# Vivado block design One_Digit, xc7a35tcpg236-1, Vivado 2018.3
create_bd_design One_Digit

create_bd_port -dir I clkin
create_bd_port -dir O A
create_bd_port -dir O B
create_bd_port -dir O C
create_bd_port -dir O D
create_bd_port -dir O E
create_bd_port -dir O F
create_bd_port -dir O G

create_bd_cell -type hier clk_divide_1Hz
create_bd_cell -type ip -vlnv xilinx.com:ip:c_counter_binary:12.0 c_counter_binary_0
set_property -dict {CONFIG.Final_Count_Value 9 CONFIG.Output_Width 4 CONFIG.Restrict_Count true} [get_bd_cells c_counter_binary_0]
create_bd_cell -type hier Seg_Decoder
create_bd_cell -type ip -vlnv xilinx.com:ip:xlslice:1.0 xlslice_0
set_property -dict {CONFIG.DIN_FROM 0 CONFIG.DIN_TO 0 CONFIG.DIN_WIDTH 4} [get_bd_cells xlslice_0]
create_bd_cell -type ip -vlnv xilinx.com:ip:xlslice:1.0 xlslice_1
set_property -dict {CONFIG.DIN_FROM 1 CONFIG.DIN_TO 1 CONFIG.DIN_WIDTH 4 CONFIG.DOUT_WIDTH 1} [get_bd_cells xlslice_1]
create_bd_cell -type ip -vlnv xilinx.com:ip:xlslice:1.0 xlslice_2
set_property -dict {CONFIG.DIN_FROM 2 CONFIG.DIN_TO 2 CONFIG.DIN_WIDTH 4 CONFIG.DOUT_WIDTH 1} [get_bd_cells xlslice_2]
create_bd_cell -type ip -vlnv xilinx.com:ip:xlslice:1.0 xlslice_3
set_property -dict {CONFIG.DIN_FROM 3 CONFIG.DIN_TO 3 CONFIG.DIN_WIDTH 4 CONFIG.DOUT_WIDTH 1} [get_bd_cells xlslice_3]

# ---- hierarchy /clk_divide_1Hz ----
current_bd_instance /clk_divide_1Hz
create_bd_pin -dir I clkin_0
create_bd_pin -dir O clkout_0

create_bd_cell -type ip -vlnv xilinx.com:xup:xup_clk_divider:1.0 xup_clk_divider_15
create_bd_cell -type ip -vlnv xilinx.com:xup:xup_clk_divider:1.0 xup_clk_divider_2
create_bd_cell -type ip -vlnv xilinx.com:xup:xup_clk_divider:1.0 xup_clk_divider_16
create_bd_cell -type ip -vlnv xilinx.com:xup:xup_clk_divider:1.0 xup_clk_divider_3
create_bd_cell -type ip -vlnv xilinx.com:xup:xup_clk_divider:1.0 xup_clk_divider_17
create_bd_cell -type ip -vlnv xilinx.com:xup:xup_clk_divider:1.0 xup_clk_divider_4
create_bd_cell -type ip -vlnv xilinx.com:xup:xup_clk_divider:1.0 xup_clk_divider_18
create_bd_cell -type ip -vlnv xilinx.com:xup:xup_clk_divider:1.0 xup_clk_divider_5
create_bd_cell -type ip -vlnv xilinx.com:xup:xup_clk_divider:1.0 xup_clk_divider_19
create_bd_cell -type ip -vlnv xilinx.com:xup:xup_clk_divider:1.0 xup_clk_divider_6
create_bd_cell -type ip -vlnv xilinx.com:xup:xup_clk_divider:1.0 xup_clk_divider_7
create_bd_cell -type ip -vlnv xilinx.com:xup:xup_clk_divider:1.0 xup_clk_divider_20
create_bd_cell -type ip -vlnv xilinx.com:xup:xup_clk_divider:1.0 xup_clk_divider_8
create_bd_cell -type ip -vlnv xilinx.com:xup:xup_clk_divider:1.0 xup_clk_divider_21
create_bd_cell -type ip -vlnv xilinx.com:xup:xup_clk_divider:1.0 xup_clk_divider_9
create_bd_cell -type ip -vlnv xilinx.com:xup:xup_clk_divider:1.0 xup_clk_divider_22
create_bd_cell -type ip -vlnv xilinx.com:xup:xup_clk_divider:1.0 xup_clk_divider_10
create_bd_cell -type ip -vlnv xilinx.com:xup:xup_clk_divider:1.0 xup_clk_divider_23
create_bd_cell -type ip -vlnv xilinx.com:xup:xup_clk_divider:1.0 xup_clk_divider_11
create_bd_cell -type ip -vlnv xilinx.com:xup:xup_clk_divider:1.0 xup_clk_divider_24
create_bd_cell -type ip -vlnv xilinx.com:xup:xup_clk_divider:1.0 xup_clk_divider_12
create_bd_cell -type ip -vlnv xilinx.com:xup:xup_clk_divider:1.0 xup_clk_divider_25
create_bd_cell -type ip -vlnv xilinx.com:xup:xup_clk_divider:1.0 xup_clk_divider_13
create_bd_cell -type ip -vlnv xilinx.com:xup:xup_clk_divider:1.0 xup_clk_divider_0
create_bd_cell -type ip -vlnv xilinx.com:xup:xup_clk_divider:1.0 xup_clk_divider_26
create_bd_cell -type ip -vlnv xilinx.com:xup:xup_clk_divider:1.0 xup_clk_divider_14
create_bd_cell -type ip -vlnv xilinx.com:xup:xup_clk_divider:1.0 xup_clk_divider_1

# ---- hierarchy /Seg_Decoder ----
current_bd_instance /Seg_Decoder
create_bd_pin -dir O A
create_bd_pin -dir O B
create_bd_pin -dir O C
create_bd_pin -dir O D
create_bd_pin -dir O E
create_bd_pin -dir O F
create_bd_pin -dir O G
create_bd_pin -dir I X0
create_bd_pin -dir I X1
create_bd_pin -dir I X2
create_bd_pin -dir I X3

create_bd_cell -type hier segment_A
create_bd_cell -type hier segment_B
create_bd_cell -type hier segment_C
create_bd_cell -type hier segment_D
create_bd_cell -type hier segment_E
create_bd_cell -type hier segment_F
create_bd_cell -type hier segment_G

# ---- hierarchy /Seg_Decoder/segment_A ----
current_bd_instance /Seg_Decoder/segment_A
create_bd_pin -dir O A
create_bd_pin -dir I X0
create_bd_pin -dir I X1
create_bd_pin -dir I X2
create_bd_pin -dir I X3

create_bd_cell -type ip -vlnv xilinx.com:xup:xup_and3:1.0 xup_and3_0
set_property -dict {CONFIG.DELAY 0} [get_bd_cells xup_and3_0]
create_bd_cell -type ip -vlnv xilinx.com:xup:xup_and4:1.0 xup_and4_0
set_property -dict {CONFIG.DELAY 0} [get_bd_cells xup_and4_0]
create_bd_cell -type ip -vlnv xilinx.com:xup:xup_inv:1.0 xup_inv_0
set_property -dict {CONFIG.DELAY 0} [get_bd_cells xup_inv_0]
create_bd_cell -type ip -vlnv xilinx.com:xup:xup_inv:1.0 xup_inv_1
set_property -dict {CONFIG.DELAY 0} [get_bd_cells xup_inv_1]
create_bd_cell -type ip -vlnv xilinx.com:xup:xup_inv:1.0 xup_inv_2
set_property -dict {CONFIG.DELAY 0} [get_bd_cells xup_inv_2]
create_bd_cell -type ip -vlnv xilinx.com:xup:xup_inv:1.0 xup_inv_3
set_property -dict {CONFIG.DELAY 0} [get_bd_cells xup_inv_3]
create_bd_cell -type ip -vlnv xilinx.com:xup:xup_inv:1.0 xup_inv_4
set_property -dict {CONFIG.DELAY 0} [get_bd_cells xup_inv_4]
create_bd_cell -type ip -vlnv xilinx.com:xup:xup_or2:1.0 xup_or2_0
set_property -dict {CONFIG.DELAY 0} [get_bd_cells xup_or2_0]

# ---- hierarchy /Seg_Decoder/segment_B ----
current_bd_instance /Seg_Decoder/segment_B
create_bd_pin -dir O B
create_bd_pin -dir I X0
create_bd_pin -dir I X1
create_bd_pin -dir I X2

create_bd_cell -type ip -vlnv xilinx.com:xup:xup_and2:1.0 xup_and2_0
set_property -dict {CONFIG.DELAY 0} [get_bd_cells xup_and2_0]
create_bd_cell -type ip -vlnv xilinx.com:xup:xup_xor2:1.0 xup_xor2_0
set_property -dict {CONFIG.DELAY 0} [get_bd_cells xup_xor2_0]

# ---- hierarchy /Seg_Decoder/segment_C ----
current_bd_instance /Seg_Decoder/segment_C
create_bd_pin -dir O C
create_bd_pin -dir I X0
create_bd_pin -dir I X1
create_bd_pin -dir I X2

create_bd_cell -type ip -vlnv xilinx.com:xup:xup_and3:1.0 xup_and3_0
set_property -dict {CONFIG.DELAY 0} [get_bd_cells xup_and3_0]
create_bd_cell -type ip -vlnv xilinx.com:xup:xup_inv:1.0 xup_inv_0
set_property -dict {CONFIG.DELAY 0} [get_bd_cells xup_inv_0]
create_bd_cell -type ip -vlnv xilinx.com:xup:xup_inv:1.0 xup_inv_1
set_property -dict {CONFIG.DELAY 0} [get_bd_cells xup_inv_1]

# ---- hierarchy /Seg_Decoder/segment_D ----
current_bd_instance /Seg_Decoder/segment_D
create_bd_pin -dir O D
create_bd_pin -dir I X0
create_bd_pin -dir I X1
create_bd_pin -dir I X2
create_bd_pin -dir I X3

create_bd_cell -type ip -vlnv xilinx.com:xup:xup_and2:1.0 xup_and2_0
set_property -dict {CONFIG.DELAY 0} [get_bd_cells xup_and2_0]
create_bd_cell -type ip -vlnv xilinx.com:xup:xup_and4:1.0 xup_and4_0
set_property -dict {CONFIG.DELAY 0} [get_bd_cells xup_and4_0]
create_bd_cell -type ip -vlnv xilinx.com:xup:xup_inv:1.0 xup_inv_0
set_property -dict {CONFIG.DELAY 0} [get_bd_cells xup_inv_0]
create_bd_cell -type ip -vlnv xilinx.com:xup:xup_inv:1.0 xup_inv_1
set_property -dict {CONFIG.DELAY 0} [get_bd_cells xup_inv_1]
create_bd_cell -type ip -vlnv xilinx.com:xup:xup_inv:1.0 xup_inv_2
set_property -dict {CONFIG.DELAY 0} [get_bd_cells xup_inv_2]
create_bd_cell -type ip -vlnv xilinx.com:xup:xup_inv:1.0 xup_inv_3
set_property -dict {CONFIG.DELAY 0} [get_bd_cells xup_inv_3]
create_bd_cell -type ip -vlnv xilinx.com:xup:xup_or2:1.0 xup_or2_0
set_property -dict {CONFIG.DELAY 0} [get_bd_cells xup_or2_0]
create_bd_cell -type ip -vlnv xilinx.com:xup:xup_xor2:1.0 xup_xor2_0
set_property -dict {CONFIG.DELAY 0} [get_bd_cells xup_xor2_0]

# ---- hierarchy /Seg_Decoder/segment_E ----
current_bd_instance /Seg_Decoder/segment_E
create_bd_pin -dir O E
create_bd_pin -dir I X0
create_bd_pin -dir I X1
create_bd_pin -dir I X2

create_bd_cell -type ip -vlnv xilinx.com:xup:xup_and2:1.0 xup_and2_0
set_property -dict {CONFIG.DELAY 0} [get_bd_cells xup_and2_0]
create_bd_cell -type ip -vlnv xilinx.com:xup:xup_inv:1.0 xup_inv_0
set_property -dict {CONFIG.DELAY 0} [get_bd_cells xup_inv_0]
create_bd_cell -type ip -vlnv xilinx.com:xup:xup_or2:1.0 xup_or2_0
set_property -dict {CONFIG.DELAY 0} [get_bd_cells xup_or2_0]

# ---- hierarchy /Seg_Decoder/segment_F ----
current_bd_instance /Seg_Decoder/segment_F
create_bd_pin -dir O F
create_bd_pin -dir I X0
create_bd_pin -dir I X1
create_bd_pin -dir I X2
create_bd_pin -dir I X3

create_bd_cell -type ip -vlnv xilinx.com:xup:xup_and2:1.0 xup_and2_0
set_property -dict {CONFIG.DELAY 0} [get_bd_cells xup_and2_0]
create_bd_cell -type ip -vlnv xilinx.com:xup:xup_and2:1.0 xup_and2_1
set_property -dict {CONFIG.DELAY 0} [get_bd_cells xup_and2_1]
create_bd_cell -type ip -vlnv xilinx.com:xup:xup_and2:1.0 xup_and2_2
set_property -dict {CONFIG.DELAY 0} [get_bd_cells xup_and2_2]
create_bd_cell -type ip -vlnv xilinx.com:xup:xup_inv:1.0 xup_inv_0
set_property -dict {CONFIG.DELAY 0} [get_bd_cells xup_inv_0]
create_bd_cell -type ip -vlnv xilinx.com:xup:xup_inv:1.0 xup_inv_2
set_property -dict {CONFIG.DELAY 0} [get_bd_cells xup_inv_2]
create_bd_cell -type ip -vlnv xilinx.com:xup:xup_or2:1.0 xup_or2_0
set_property -dict {CONFIG.DELAY 0} [get_bd_cells xup_or2_0]
create_bd_cell -type ip -vlnv xilinx.com:xup:xup_or2:1.0 xup_or2_1
set_property -dict {CONFIG.DELAY 0} [get_bd_cells xup_or2_1]

# ---- hierarchy /Seg_Decoder/segment_G ----
current_bd_instance /Seg_Decoder/segment_G
create_bd_pin -dir O G
create_bd_pin -dir I X0
create_bd_pin -dir I X1
create_bd_pin -dir I X2
create_bd_pin -dir I X3

create_bd_cell -type ip -vlnv xilinx.com:xup:xup_and3:1.0 xup_and3_0
set_property -dict {CONFIG.DELAY 0} [get_bd_cells xup_and3_0]
create_bd_cell -type ip -vlnv xilinx.com:xup:xup_and3:1.0 xup_and3_1
set_property -dict {CONFIG.DELAY 0} [get_bd_cells xup_and3_1]
create_bd_cell -type ip -vlnv xilinx.com:xup:xup_inv:1.0 xup_inv_0
set_property -dict {CONFIG.DELAY 0} [get_bd_cells xup_inv_0]
create_bd_cell -type ip -vlnv xilinx.com:xup:xup_inv:1.0 xup_inv_1
set_property -dict {CONFIG.DELAY 0} [get_bd_cells xup_inv_1]
create_bd_cell -type ip -vlnv xilinx.com:xup:xup_inv:1.0 xup_inv_2
set_property -dict {CONFIG.DELAY 0} [get_bd_cells xup_inv_2]
create_bd_cell -type ip -vlnv xilinx.com:xup:xup_or2:1.0 xup_or2_0
set_property -dict {CONFIG.DELAY 0} [get_bd_cells xup_or2_0]

# ---- connections ----

current_bd_instance /clk_divide_1Hz
connect_bd_net [get_bd_pins xup_clk_divider_14/clkout] [get_bd_pins xup_clk_divider_15/clkin]
connect_bd_net [get_bd_pins xup_clk_divider_15/clkout] [get_bd_pins xup_clk_divider_16/clkin]
connect_bd_net [get_bd_pins xup_clk_divider_1/clkout] [get_bd_pins xup_clk_divider_2/clkin]
connect_bd_net [get_bd_pins xup_clk_divider_2/clkout] [get_bd_pins xup_clk_divider_3/clkin]
connect_bd_net [get_bd_pins xup_clk_divider_16/clkout] [get_bd_pins xup_clk_divider_17/clkin]
connect_bd_net [get_bd_pins xup_clk_divider_3/clkout] [get_bd_pins xup_clk_divider_4/clkin]
connect_bd_net [get_bd_pins xup_clk_divider_17/clkout] [get_bd_pins xup_clk_divider_18/clkin]
connect_bd_net [get_bd_pins xup_clk_divider_4/clkout] [get_bd_pins xup_clk_divider_5/clkin]
connect_bd_net [get_bd_pins xup_clk_divider_18/clkout] [get_bd_pins xup_clk_divider_19/clkin]
connect_bd_net [get_bd_pins xup_clk_divider_5/clkout] [get_bd_pins xup_clk_divider_6/clkin]
connect_bd_net [get_bd_pins xup_clk_divider_19/clkout] [get_bd_pins xup_clk_divider_20/clkin]
connect_bd_net [get_bd_pins xup_clk_divider_6/clkout] [get_bd_pins xup_clk_divider_7/clkin]
connect_bd_net [get_bd_pins xup_clk_divider_7/clkout] [get_bd_pins xup_clk_divider_8/clkin]
connect_bd_net [get_bd_pins xup_clk_divider_20/clkout] [get_bd_pins xup_clk_divider_21/clkin]
connect_bd_net [get_bd_pins xup_clk_divider_8/clkout] [get_bd_pins xup_clk_divider_9/clkin]
connect_bd_net [get_bd_pins xup_clk_divider_21/clkout] [get_bd_pins xup_clk_divider_22/clkin]
connect_bd_net [get_bd_pins xup_clk_divider_9/clkout] [get_bd_pins xup_clk_divider_10/clkin]
connect_bd_net [get_bd_pins xup_clk_divider_22/clkout] [get_bd_pins xup_clk_divider_23/clkin]
connect_bd_net [get_bd_pins xup_clk_divider_10/clkout] [get_bd_pins xup_clk_divider_11/clkin]
connect_bd_net [get_bd_pins xup_clk_divider_23/clkout] [get_bd_pins xup_clk_divider_24/clkin]
connect_bd_net [get_bd_pins xup_clk_divider_11/clkout] [get_bd_pins xup_clk_divider_12/clkin]
connect_bd_net [get_bd_pins xup_clk_divider_24/clkout] [get_bd_pins xup_clk_divider_25/clkin]
connect_bd_net [get_bd_pins xup_clk_divider_12/clkout] [get_bd_pins xup_clk_divider_13/clkin]
connect_bd_net [get_bd_pins xup_clk_divider_25/clkout] [get_bd_pins xup_clk_divider_26/clkin]
connect_bd_net [get_bd_pins xup_clk_divider_13/clkout] [get_bd_pins xup_clk_divider_14/clkin]
connect_bd_net [get_bd_pins xup_clk_divider_0/clkout] [get_bd_pins xup_clk_divider_1/clkin]
connect_bd_net -net clkin_0_1 [get_bd_pins clkin_0] [get_bd_pins xup_clk_divider_0/clkin]
connect_bd_net [get_bd_pins xup_clk_divider_26/clkout] [get_bd_pins clkout_0]

current_bd_instance /Seg_Decoder
connect_bd_net -net a_0_1 [get_bd_pins X2] \
  [get_bd_pins segment_A/X2] [get_bd_pins segment_B/X2] [get_bd_pins segment_C/X2] [get_bd_pins segment_D/X2] \
  [get_bd_pins segment_E/X2] [get_bd_pins segment_F/X2] [get_bd_pins segment_G/X2]
connect_bd_net -net a_0_2 [get_bd_pins X3] [get_bd_pins segment_A/X3] [get_bd_pins segment_D/X3] [get_bd_pins segment_F/X3] [get_bd_pins segment_G/X3]
connect_bd_net -net a_1_1 [get_bd_pins X1] \
  [get_bd_pins segment_A/X1] [get_bd_pins segment_B/X1] [get_bd_pins segment_C/X1] [get_bd_pins segment_D/X1] \
  [get_bd_pins segment_E/X1] [get_bd_pins segment_F/X1] [get_bd_pins segment_G/X1]
connect_bd_net -net a_2_1 [get_bd_pins X0] \
  [get_bd_pins segment_A/X0] [get_bd_pins segment_B/X0] [get_bd_pins segment_C/X0] [get_bd_pins segment_D/X0] \
  [get_bd_pins segment_E/X0] [get_bd_pins segment_F/X0] [get_bd_pins segment_G/X0]
connect_bd_net -net xup_and2_0_y [get_bd_pins segment_B/B] [get_bd_pins B]
connect_bd_net -net xup_and3_0_y [get_bd_pins segment_C/C] [get_bd_pins C]
connect_bd_net -net xup_or2_0_y [get_bd_pins segment_A/A] [get_bd_pins A]
connect_bd_net -net xup_or2_0_y1 [get_bd_pins segment_D/D] [get_bd_pins D]
connect_bd_net -net xup_or2_0_y2 [get_bd_pins segment_E/E] [get_bd_pins E]
connect_bd_net -net xup_or2_0_y3 [get_bd_pins segment_G/G] [get_bd_pins G]
connect_bd_net -net xup_or3_0_y [get_bd_pins segment_F/F] [get_bd_pins F]

current_bd_instance /Seg_Decoder/segment_A
connect_bd_net -net a_0_1 [get_bd_pins X2] [get_bd_pins xup_and3_0/a] [get_bd_pins xup_inv_3/a]
connect_bd_net -net a_0_2 [get_bd_pins X3] [get_bd_pins xup_inv_2/a]
connect_bd_net -net a_1_1 [get_bd_pins X1] [get_bd_pins xup_inv_0/a] [get_bd_pins xup_inv_4/a]
connect_bd_net -net a_2_1 [get_bd_pins X0] [get_bd_pins xup_and4_0/d] [get_bd_pins xup_inv_1/a]
connect_bd_net [get_bd_pins xup_and3_0/y] [get_bd_pins xup_or2_0/a]
connect_bd_net [get_bd_pins xup_and4_0/y] [get_bd_pins xup_or2_0/b]
connect_bd_net [get_bd_pins xup_inv_0/y] [get_bd_pins xup_and3_0/b]
connect_bd_net [get_bd_pins xup_inv_1/y] [get_bd_pins xup_and3_0/c]
connect_bd_net [get_bd_pins xup_inv_2/y] [get_bd_pins xup_and4_0/a]
connect_bd_net [get_bd_pins xup_inv_3/y] [get_bd_pins xup_and4_0/b]
connect_bd_net [get_bd_pins xup_inv_4/y] [get_bd_pins xup_and4_0/c]
connect_bd_net [get_bd_pins xup_or2_0/y] [get_bd_pins A]

current_bd_instance /Seg_Decoder/segment_B
connect_bd_net -net X0_1 [get_bd_pins X0] [get_bd_pins xup_xor2_0/b]
connect_bd_net -net X1_1 [get_bd_pins X1] [get_bd_pins xup_xor2_0/a]
connect_bd_net -net X2_1 [get_bd_pins X2] [get_bd_pins xup_and2_0/b]
connect_bd_net [get_bd_pins xup_and2_0/y] [get_bd_pins B]
connect_bd_net [get_bd_pins xup_xor2_0/y] [get_bd_pins xup_and2_0/a]

current_bd_instance /Seg_Decoder/segment_C
connect_bd_net -net a_0_1 [get_bd_pins X2] [get_bd_pins xup_inv_0/a]
connect_bd_net -net a_1_1 [get_bd_pins X0] [get_bd_pins xup_inv_1/a]
connect_bd_net -net b_0_1 [get_bd_pins X1] [get_bd_pins xup_and3_0/b]
connect_bd_net [get_bd_pins xup_and3_0/y] [get_bd_pins C]
connect_bd_net [get_bd_pins xup_inv_0/y] [get_bd_pins xup_and3_0/a]
connect_bd_net [get_bd_pins xup_inv_1/y] [get_bd_pins xup_and3_0/c]

current_bd_instance /Seg_Decoder/segment_D
connect_bd_net -net a_0_1 [get_bd_pins X1] [get_bd_pins xup_inv_0/a] [get_bd_pins xup_inv_2/a]
connect_bd_net -net a_1_1 [get_bd_pins X2] [get_bd_pins xup_and2_0/a] [get_bd_pins xup_inv_3/a]
connect_bd_net -net a_2_1 [get_bd_pins X3] [get_bd_pins xup_inv_1/a]
connect_bd_net -net d_0_1 [get_bd_pins X0] [get_bd_pins xup_and4_0/d] [get_bd_pins xup_xor2_0/b]
connect_bd_net [get_bd_pins xup_and2_0/y] [get_bd_pins xup_or2_0/a]
connect_bd_net [get_bd_pins xup_and4_0/y] [get_bd_pins xup_or2_0/b]
connect_bd_net [get_bd_pins xup_inv_0/y] [get_bd_pins xup_xor2_0/a]
connect_bd_net [get_bd_pins xup_inv_1/y] [get_bd_pins xup_and4_0/a]
connect_bd_net [get_bd_pins xup_inv_2/y] [get_bd_pins xup_and4_0/c]
connect_bd_net [get_bd_pins xup_inv_3/y] [get_bd_pins xup_and4_0/b]
connect_bd_net [get_bd_pins xup_or2_0/y] [get_bd_pins D]
connect_bd_net [get_bd_pins xup_xor2_0/y] [get_bd_pins xup_and2_0/b]

current_bd_instance /Seg_Decoder/segment_E
connect_bd_net -net a_0_1 [get_bd_pins X1] [get_bd_pins xup_inv_0/a]
connect_bd_net -net b_0_1 [get_bd_pins X2] [get_bd_pins xup_and2_0/b]
connect_bd_net -net b_1_1 [get_bd_pins X0] [get_bd_pins xup_or2_0/b]
connect_bd_net [get_bd_pins xup_and2_0/y] [get_bd_pins xup_or2_0/a]
connect_bd_net [get_bd_pins xup_inv_0/y] [get_bd_pins xup_and2_0/a]
connect_bd_net [get_bd_pins xup_or2_0/y] [get_bd_pins E]

current_bd_instance /Seg_Decoder/segment_F
connect_bd_net -net X0_1 [get_bd_pins X0] [get_bd_pins xup_and2_1/a] [get_bd_pins xup_and2_2/a]
connect_bd_net -net X1_1 [get_bd_pins X1] [get_bd_pins xup_and2_2/b] [get_bd_pins xup_or2_1/b]
connect_bd_net -net X2_1 [get_bd_pins X2] [get_bd_pins xup_inv_0/a]
connect_bd_net -net X3_1 [get_bd_pins X3] [get_bd_pins xup_inv_2/a]
connect_bd_net [get_bd_pins xup_and2_0/y] [get_bd_pins xup_or2_0/b]
connect_bd_net [get_bd_pins xup_and2_1/y] [get_bd_pins xup_or2_1/a]
connect_bd_net [get_bd_pins xup_and2_2/y] [get_bd_pins xup_or2_0/a]
connect_bd_net [get_bd_pins xup_inv_0/y] [get_bd_pins xup_and2_0/a]
connect_bd_net [get_bd_pins xup_inv_2/y] [get_bd_pins xup_and2_1/b]
connect_bd_net [get_bd_pins xup_or2_0/y] [get_bd_pins F]
connect_bd_net [get_bd_pins xup_or2_1/y] [get_bd_pins xup_and2_0/b]

current_bd_instance /Seg_Decoder/segment_G
connect_bd_net -net a_0_1 [get_bd_pins X3] [get_bd_pins xup_inv_0/a]
connect_bd_net -net a_1_1 [get_bd_pins X2] [get_bd_pins xup_and3_1/a] [get_bd_pins xup_inv_1/a]
connect_bd_net -net a_2_1 [get_bd_pins X1] [get_bd_pins xup_and3_1/b] [get_bd_pins xup_inv_2/a]
connect_bd_net -net c_0_1 [get_bd_pins X0] [get_bd_pins xup_and3_1/c]
connect_bd_net [get_bd_pins xup_and3_0/y] [get_bd_pins xup_or2_0/a]
connect_bd_net [get_bd_pins xup_and3_1/y] [get_bd_pins xup_or2_0/b]
connect_bd_net [get_bd_pins xup_inv_0/y] [get_bd_pins xup_and3_0/a]
connect_bd_net [get_bd_pins xup_inv_1/y] [get_bd_pins xup_and3_0/b]
connect_bd_net [get_bd_pins xup_inv_2/y] [get_bd_pins xup_and3_0/c]
connect_bd_net [get_bd_pins xup_or2_0/y] [get_bd_pins G]

current_bd_instance /
connect_bd_net -net clk_devide_1Hz_clkout_0 [get_bd_pins clk_divide_1Hz/clkout_0] [get_bd_pins c_counter_binary_0/CLK]
connect_bd_net -net clkin_0_1 [get_bd_ports clkin] [get_bd_pins clk_divide_1Hz/clkin_0]
connect_bd_net -net xup_and2_0_y [get_bd_pins Seg_Decoder/B] [get_bd_ports B]
connect_bd_net -net xup_and3_0_y [get_bd_pins Seg_Decoder/C] [get_bd_ports C]
connect_bd_net -net xup_or2_0_y [get_bd_pins Seg_Decoder/A] [get_bd_ports A]
connect_bd_net -net xup_or2_0_y1 [get_bd_pins Seg_Decoder/D] [get_bd_ports D]
connect_bd_net -net xup_or2_0_y2 [get_bd_pins Seg_Decoder/E] [get_bd_ports E]
connect_bd_net -net xup_or2_0_y3 [get_bd_pins Seg_Decoder/G] [get_bd_ports G]
connect_bd_net -net xup_or3_0_y [get_bd_pins Seg_Decoder/F] [get_bd_ports F]
connect_bd_net [get_bd_pins c_counter_binary_0/Q] \
  [get_bd_pins xlslice_0/Din] [get_bd_pins xlslice_1/Din] [get_bd_pins xlslice_2/Din] [get_bd_pins xlslice_3/Din]
connect_bd_net [get_bd_pins xlslice_0/Dout] [get_bd_pins Seg_Decoder/X0]
connect_bd_net [get_bd_pins xlslice_1/Dout] [get_bd_pins Seg_Decoder/X1]
connect_bd_net [get_bd_pins xlslice_2/Dout] [get_bd_pins Seg_Decoder/X2]
connect_bd_net [get_bd_pins xlslice_3/Dout] [get_bd_pins Seg_Decoder/X3]

validate_bd_design
save_bd_design
